# EAGLE schematic RFMXX (EAGLE 9.5.2)
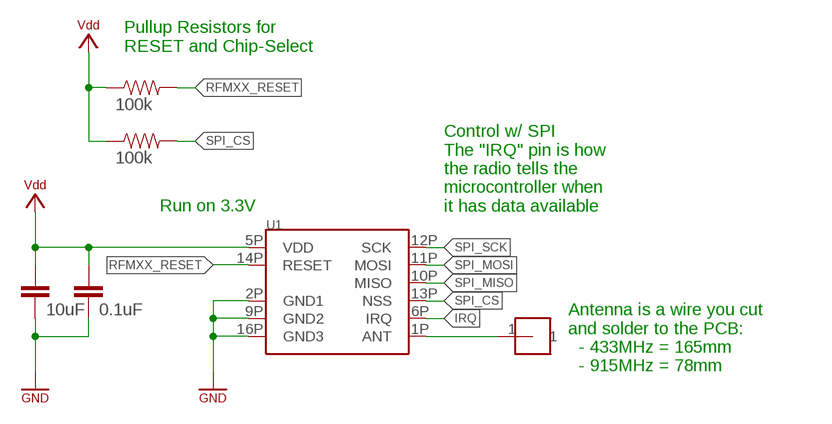
[diagram p0: schematic, sheet 1]

## Parts
C1  10uF  COMPONENT_CAP-0805  [0805]
C2  0.1uF  COMPONENT_CAP-0805  [0805]
R1  100k  COMPONENT_RESISTOR-0805  [0805]
R2  100k  COMPONENT_RESISTOR-0805  [0805]
U1  RADIO_RFMXX_SMT  [RFMXX_SMT]
U$1  HEADER-1-DIP  [HEADER-1-DIP]

## Nets
GND: C1.2 C2.2 U1.2P(GND1) U1.9P(GND2) U1.16P(GND3) ; supply symbol labelled SYMBOL_GND
IRQ: U1.6P(IRQ)
N$7: U1.1P(ANT) U$1.1
RFMXX_RESET: R2.2 U1.14P(RESET)
SPI_CS: R1.2 U1.13P(NSS)
SPI_MISO: U1.10P(MISO)
SPI_MOSI: U1.11P(MOSI)
SPI_SCK: U1.12P(SCK)
VDD: C1.1 C2.1 R1.1 R2.1 U1.5P(VDD) ; supply symbol labelled SYMBOL_VDD

## Notes on the sheet
- Pullup Resistors for
  RESET and Chip-Select
- Run on 3.3V
- Control w/ SPI
  The "IRQ" pin is how
  the radio tells the
  microcontroller when
  it has data available
- Antenna is a wire you cut
  and solder to the PCB:
    - 433MHz = 165mm
    - 915MHz = 78mm

## Library data of the parts
C1 C2 = homemade-hardware:COMPONENT_CAP: Capacitor Standard 0603 ceramic capacitor, and 0.1" leaded capacitor.
R1 R2 = homemade-hardware:COMPONENT_RESISTOR
U1 = homemade-hardware:RADIO_RFMXX: RFM69HCW <https://www.digikey.com/product-detail/en/sparkfun-electronics/COM-13909/1568-1394-ND/6023504>: - ISM Band RF Transceiver - 433MHz or 915MHz (868MHz in EU) RFM95W <https://www.digikey.com/product-detail/en/rf-solutions/RFM95W-915S2/RFM95W-915S2-ND/6564923>: - LoRa Transceiver - 915MHz (868MHz in EU)
U$1 = homemade-hardware:HEADER-1: M20-8890845 <https://www.digikey.com/products/en?keywords=952-3236-ND>: Horizontal Male SMD Headers M20-7910842R <https://www.digikey.com/product-detail/en/harwin-inc/M20-7910842R/952-3200-6-ND/6559341>: Horizontal Female SMD Headers